# Altium schematic sheet NB3000_Unique_MAC.SchDoc
size A
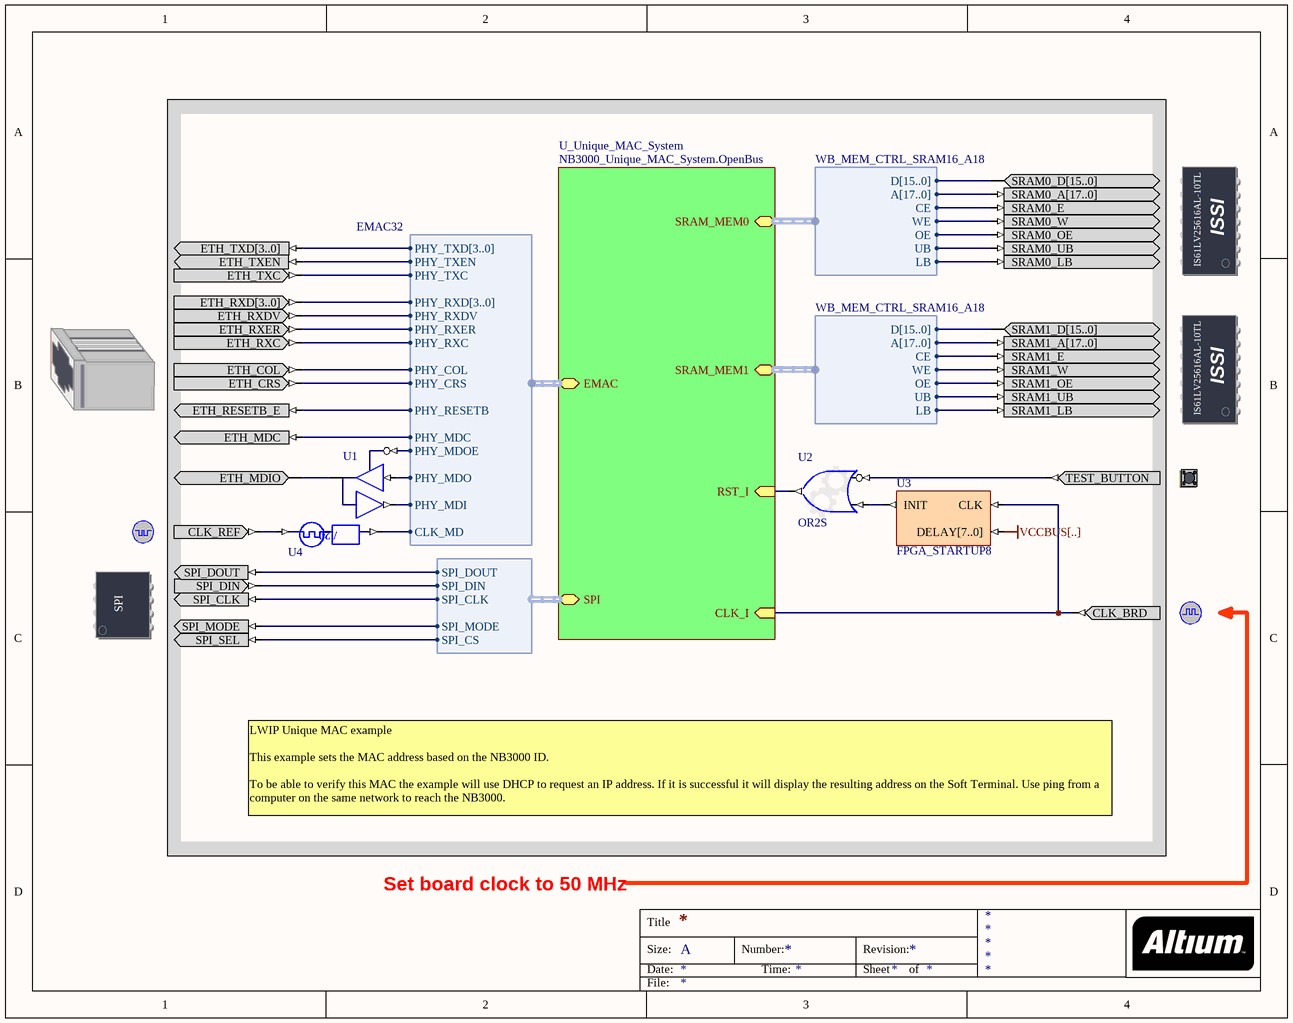
[diagram p0: NB3000_Unique_MAC.SchDoc]

## Parts
(Parts that share a designator on the sheet are numbered #1, #2 ... from top to bottom, then left to right.)
?#1  SRAM0  (value not drawn)
?#2  ETH_PHY  (value not drawn)
?#3  SRAM1  (value not drawn)
?#4  TEST_BUTTON  (value not drawn)
?#5  CLOCK_REFERENCE  (value not drawn)
?#6  SERIALFMEMORY  (value not drawn)
?#7  CLOCK_BOARD  (value not drawn)
U1  IOBUF  (value not drawn)
U2  OR2S
U3  FPGA_STARTUP8
U4  CDIV20DC50  (value not drawn)

## Sub-sheets
U_Unique_MAC_System = NB3000_Unique_MAC_System.OpenBus: RST_I (in), CLK_I (in), SRAM_MEM0 (harness WB_MEM_CTRL_SRAM16_A18), SRAM_MEM1 (harness WB_MEM_CTRL_SRAM16_A18), EMAC (harness EMAC32), SPI (harness SPI_W_NB)

## Harnesses
EMAC32: PHY_TXD[3..0], PHY_TXEN, PHY_TXC, PHY_RXD[3..0], PHY_RXDV, PHY_RXER, PHY_RXC, PHY_COL, PHY_CRS, PHY_RESETB, PHY_MDC, PHY_MDOE, PHY_MDO, PHY_MDI, CLK_MD
WB_MEM_CTRL_SRAM16_A18: D[15..0], A[17..0], CE, WE, OE, UB, LB
SPI_W_NB: SPI_DOUT, SPI_DIN, SPI_CLK, SPI_MODE, SPI_CS

## Nets
VCCBUS[..]: U3.DELAY[7..0]
Net?#1_SRAM0_A[17..0]: ?#1.SRAM0_A[17..0] ; sheet U_Unique_MAC_System/SRAM_MEM0.A[17..0]
Net?#1_SRAM0_D[15..0]: ?#1.SRAM0_D[15..0] ; sheet U_Unique_MAC_System/SRAM_MEM0.D[15..0]
Net?#1_SRAM0_E: ?#1.SRAM0_E ; sheet U_Unique_MAC_System/SRAM_MEM0.CE
Net?#1_SRAM0_LB: ?#1.SRAM0_LB ; sheet U_Unique_MAC_System/SRAM_MEM0.LB
Net?#1_SRAM0_OE: ?#1.SRAM0_OE ; sheet U_Unique_MAC_System/SRAM_MEM0.OE
Net?#1_SRAM0_UB: ?#1.SRAM0_UB ; sheet U_Unique_MAC_System/SRAM_MEM0.UB
Net?#1_SRAM0_W: ?#1.SRAM0_W ; sheet U_Unique_MAC_System/SRAM_MEM0.WE
Net?#2_ETH_COL: ?#2.ETH_COL ; sheet U_Unique_MAC_System/EMAC.PHY_COL
Net?#2_ETH_CRS: ?#2.ETH_CRS ; sheet U_Unique_MAC_System/EMAC.PHY_CRS
Net?#2_ETH_MDC: ?#2.ETH_MDC ; sheet U_Unique_MAC_System/EMAC.PHY_MDC
Net?#2_ETH_MDIO: ?#2.ETH_MDIO U1.IO
Net?#2_ETH_RESETB_E: ?#2.ETH_RESETB_E ; sheet U_Unique_MAC_System/EMAC.PHY_RESETB
Net?#2_ETH_RXC: ?#2.ETH_RXC ; sheet U_Unique_MAC_System/EMAC.PHY_RXC
Net?#2_ETH_RXD[3..0]: ?#2.ETH_RXD[3..0] ; sheet U_Unique_MAC_System/EMAC.PHY_RXD[3..0]
Net?#2_ETH_RXDV: ?#2.ETH_RXDV ; sheet U_Unique_MAC_System/EMAC.PHY_RXDV
Net?#2_ETH_RXER: ?#2.ETH_RXER ; sheet U_Unique_MAC_System/EMAC.PHY_RXER
Net?#2_ETH_TXC: ?#2.ETH_TXC ; sheet U_Unique_MAC_System/EMAC.PHY_TXC
Net?#2_ETH_TXD[3..0]: ?#2.ETH_TXD[3..0] ; sheet U_Unique_MAC_System/EMAC.PHY_TXD[3..0]
Net?#2_ETH_TXEN: ?#2.ETH_TXEN ; sheet U_Unique_MAC_System/EMAC.PHY_TXEN
Net?#3_SRAM1_A[17..0]: ?#3.SRAM1_A[17..0] ; sheet U_Unique_MAC_System/SRAM_MEM1.A[17..0]
Net?#3_SRAM1_D[15..0]: ?#3.SRAM1_D[15..0] ; sheet U_Unique_MAC_System/SRAM_MEM1.D[15..0]
Net?#3_SRAM1_E: ?#3.SRAM1_E ; sheet U_Unique_MAC_System/SRAM_MEM1.CE
Net?#3_SRAM1_LB: ?#3.SRAM1_LB ; sheet U_Unique_MAC_System/SRAM_MEM1.LB
Net?#3_SRAM1_OE: ?#3.SRAM1_OE ; sheet U_Unique_MAC_System/SRAM_MEM1.OE
Net?#3_SRAM1_UB: ?#3.SRAM1_UB ; sheet U_Unique_MAC_System/SRAM_MEM1.UB
Net?#3_SRAM1_W: ?#3.SRAM1_W ; sheet U_Unique_MAC_System/SRAM_MEM1.WE
Net?#4_TEST_BUTTON: ?#4.TEST_BUTTON U2.I0
Net?#5_CLK_REF: ?#5.CLK_REF U4.CLKIN
Net?#6_SPI_CLK: ?#6.SPI_CLK ; sheet U_Unique_MAC_System/SPI.SPI_CLK
Net?#6_SPI_DIN: ?#6.SPI_DIN ; sheet U_Unique_MAC_System/SPI.SPI_DIN
Net?#6_SPI_DOUT: ?#6.SPI_DOUT ; sheet U_Unique_MAC_System/SPI.SPI_DOUT
Net?#6_SPI_MODE: ?#6.SPI_MODE ; sheet U_Unique_MAC_System/SPI.SPI_MODE
Net?#6_SPI_SEL: ?#6.SPI_SEL ; sheet U_Unique_MAC_System/SPI.SPI_CS
Net?#7_CLK_BRD: ?#7.CLK_BRD U3.CLK ; sheet U_Unique_MAC_System/CLK_I
NetU1_I: U1.I ; sheet U_Unique_MAC_System/EMAC.PHY_MDO
NetU1_O: U1.O ; sheet U_Unique_MAC_System/EMAC.PHY_MDI
NetU1_T: U1.T ; sheet U_Unique_MAC_System/EMAC.PHY_MDOE
NetU2_I1: U2.I1 U3.INIT
NetU2_O: U2.O ; sheet U_Unique_MAC_System/RST_I
NetU4_CLKDV: U4.CLKDV ; sheet U_Unique_MAC_System/EMAC.CLK_MD

## Notes on the sheet
- LWIP Unique MAC example
  This example sets the MAC address based on the NB3000 ID.
  To be able to verify this MAC the example will use DHCP to request an IP address. If it is successful it will display the resulting address on the Soft Terminal. Use ping from a computer on the same network to reach the NB3000.
- Set board clock to 50 MHz
- Title
- Size:
- Date:
- A
- Number:
- Time:
- Revision:
- Sheet
- of
- File:
- (in symbol CDIV20DC50) / 20
- (in symbol SPI_BUS) SPI
- (in symbol SRAM0) ISSI; IS61LV25616AL-10TL
- (in symbol SRAM1) ISSI; IS61LV25616AL-10TL

## Library data of the parts
?#1 = SRAM0: Free Static RAM - Daughterboard; PortComponent: True; Published: 14-May-2007; Publisher: Altium Limited; HelpURL: https://wiki.altium.com/display/ADOH/NanoBoard+3000+-+Independent+SRAM
?#2 = ETH_PHY: Ethernet PHY-interface; PortComponent: True; Published: 22-Jan-2007; Publisher: Altium Limited; HelpURL: https://wiki.altium.com/display/ADOH/NanoBoard+3000+-+Ethernet+Port
?#3 = SRAM1: Free Static RAM - Daughterboard; PortComponent: True; Published: 14-May-2007; Publisher: Altium Limited; HelpURL: https://wiki.altium.com/display/ADOH/NanoBoard+3000+-+Independent+SRAM
?#4 = TEST_BUTTON: Test / Reset Button; PortComponent: True; Published: 19-Nov-2003; Publisher: Altium Limited; HelpURL: TR0143 Technical Reference Manual for Altium's Desktop NanoBoard NB2DSK01.pdf#page=53
?#5 = CLOCK_REFERENCE: Global System Clock Reference Supply; PortComponent: True; Published: 19-Nov-2003; Publisher: Altium Limited; HelpURL: TR0143 Technical Reference Manual for Altium's Desktop NanoBoard NB2DSK01.pdf#page=41
?#6 = SPI_BUS: Serial SPI Flash RAM; PortComponent: True; Published: 19-Nov-2003; Publisher: Altium Limited; HelpURL: https://wiki.altium.com/display/ADOH/Using+Multiple+SPI+and+I2C+Devices+in+a+Design; UseInDSF: True
?#7 = CLOCK_BOARD: Global System Clock Supply; PortComponent: True; Published: 19-Nov-2003; Publisher: Altium Limited; HelpURL: TR0143 Technical Reference Manual for Altium's Desktop NanoBoard NB2DSK01.pdf#page=41; UseInDSF: True
U1 = iobuf: Input/Output Buffer; Enable: Low; Control: Common Control T; ArchiveName: GENERIC; VHDLIB_SIM: GENERIC_LIB; Published: 29-Jan-2004; Publisher: Altium Limited; XilinxEquivalent: IOBUF; LastRevisionNo: 1.00.00; HelpURL: CR0118 FPGA Generic Library Guide.pdf#page=293; ComponentLink1URL: CR0125 FPGA Buffer Resource Usage.pdf#page=78; ComponentLink1Description: Core &Resource Usage; FunctionalClass: Buffer; SubClass: IOBUF
U2 = GATE: Configurable Generic Gate; ConfiguratorName: GENERIC_GATE; ConfigurationParameters: {}Version[1.0]{}GateKind[OR]{}BusInput[False]{}GateInputType[Bit]{}GateOutputOption[Normal]{}BusWidth[8]{}RegisterOutputs[False]{}NegativeClockEdge[False]{}InputCount[2]{}InputInvert0[True]{}InputInvert1[False]{}; LastRevisionNo: 1.00.00; Published: 3-Sep-2008; Publisher: Altium Limited
U3 = FPGA_STARTUP8: FPGA Startup With 8 Bit Delay; Published: 9-Dec-2004; Publisher: Altium Limited; HelpURL: CR0119 FPGA_STARTUPx Powerup Delay Unit.pdf; LastRevisionNo: 1.00.00; ComponentLink1Description: Core &Resource Usage; ComponentLink1URL: CR0139 FPGA Peripheral Resource Usage.pdf#page=11
U4 = CDIV20DC50: Clock Divider by 20 with 50% Duty Cycle Output; DivisorRate: 20; DutyCycle: 50; ArchiveName: GENERIC; VHDLIB_SIM: GENERIC_LIB; Published: 29-Jan-2004; Publisher: Altium Limited; LastRevisionNo: 1.00.00; HelpURL: CR0118 FPGA Generic Library Guide.pdf#page=143; ComponentLink1URL: CR0127 FPGA Clock Divider Resource Usage.pdf#page=21; ComponentLink1Description: Core &Resource Usage; FunctionalClass: Clock Divider